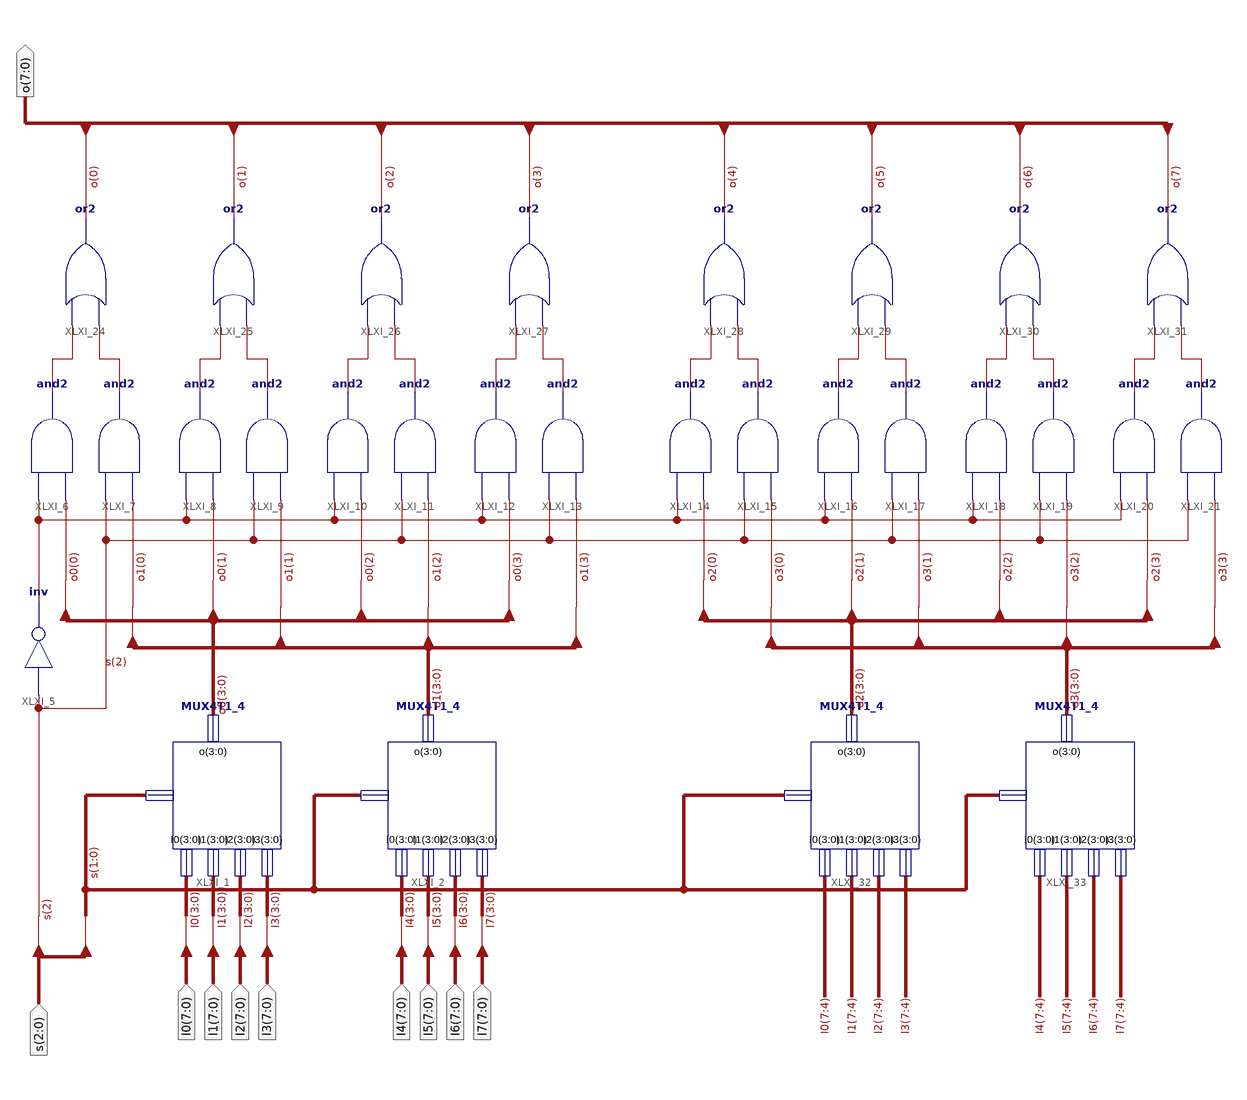
[diagram p0: schematic sheet 1]
// Xilinx ISE schematic MUX8T1_8.sch (kintex7) as structural Verilog: 29 symbols, 10 ports
module MUX8T1_8 (
  input  [2:0] s,
  input  [7:0] I0,
  input  [7:0] I1,
  input  [7:0] I2,
  input  [7:0] I3,
  input  [7:0] I7,
  input  [7:0] I6,
  input  [7:0] I5,
  input  [7:0] I4,
  output [7:0] o
);

  wire XLXN_1, XLXN_2, XLXN_3, XLXN_4, XLXN_5, XLXN_6, XLXN_7, XLXN_8, XLXN_9, XLXN_10, XLXN_11, XLXN_12,
       XLXN_13, XLXN_14, XLXN_15, XLXN_16, XLXN_26;
  wire [3:0] o0, o1, o2, o3;

  MUX4T1_4 XLXI_1 (.I0(I0[3:0]), .I1(I1[3:0]), .I2(I2[3:0]), .I3(I3[3:0]), .o(o0), .s(s[1:0]));
  MUX4T1_4 XLXI_2 (.I0(I4[3:0]), .I1(I5[3:0]), .I2(I6[3:0]), .I3(I7[3:0]), .o(o1), .s(s[1:0]));
  not XLXI_5 (XLXN_26, s[2]);
  and XLXI_6 (XLXN_1, o0[0], XLXN_26);
  and XLXI_7 (XLXN_2, o1[0], s[2]);
  and XLXI_8 (XLXN_3, o0[1], XLXN_26);
  and XLXI_9 (XLXN_4, o1[1], s[2]);
  and XLXI_10 (XLXN_5, o0[2], XLXN_26);
  and XLXI_11 (XLXN_6, o1[2], s[2]);
  and XLXI_12 (XLXN_7, o0[3], XLXN_26);
  and XLXI_13 (XLXN_8, o1[3], s[2]);
  and XLXI_14 (XLXN_9, o2[0], XLXN_26);
  and XLXI_15 (XLXN_10, o3[0], s[2]);
  and XLXI_16 (XLXN_11, o2[1], XLXN_26);
  and XLXI_17 (XLXN_12, o3[1], s[2]);
  and XLXI_18 (XLXN_13, o2[2], XLXN_26);
  and XLXI_19 (XLXN_14, o3[2], s[2]);
  and XLXI_20 (XLXN_15, o2[3], XLXN_26);
  and XLXI_21 (XLXN_16, o3[3], s[2]);
  or XLXI_24 (o[0], XLXN_2, XLXN_1);
  or XLXI_25 (o[1], XLXN_4, XLXN_3);
  or XLXI_26 (o[2], XLXN_6, XLXN_5);
  or XLXI_27 (o[3], XLXN_8, XLXN_7);
  or XLXI_28 (o[4], XLXN_10, XLXN_9);
  or XLXI_29 (o[5], XLXN_12, XLXN_11);
  or XLXI_30 (o[6], XLXN_14, XLXN_13);
  or XLXI_31 (o[7], XLXN_16, XLXN_15);
  MUX4T1_4 XLXI_32 (.I0(I0[7:4]), .I1(I1[7:4]), .I2(I2[7:4]), .I3(I3[7:4]), .o(o2), .s(s[1:0]));
  MUX4T1_4 XLXI_33 (.I0(I4[7:4]), .I1(I5[7:4]), .I2(I6[7:4]), .I3(I7[7:4]), .o(o3), .s(s[1:0]));
endmodule
